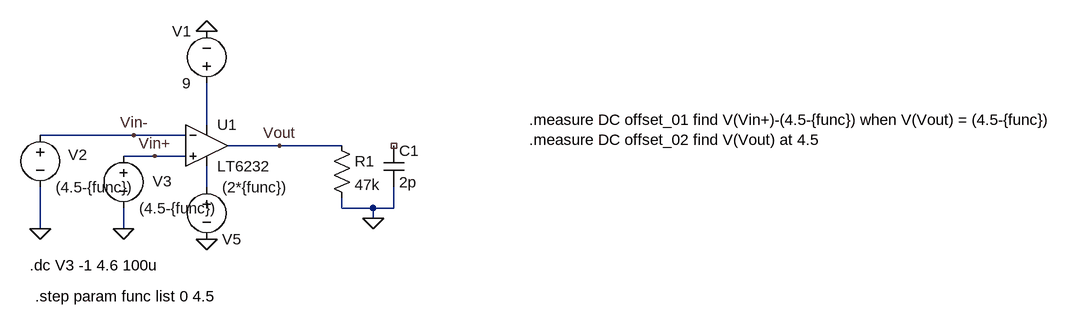
[diagram p0: schematic OpAmpTest_lt6232.asc]
OpAmpTest_lt6232.asc, the LTspice schematic file:
Version 4
SHEET 1 1664 792
WIRE 208 160 208 96
WIRE 96 176 -48 176
WIRE 176 176 96 176
WIRE 320 192 240 192
WIRE 416 192 320 192
WIRE 128 208 80 208
WIRE 176 208 128 208
WIRE 208 256 208 224
WIRE 416 288 416 272
WIRE 464 288 416 288
WIRE 496 288 496 256
WIRE 496 288 464 288
WIRE 464 304 464 288
WIRE -48 320 -48 256
WIRE 80 320 80 288
FLAG 208 16 0
FLAG 464 304 0
FLAG 80 320 0
FLAG -48 320 0
FLAG 96 176 Vin-
FLAG 128 208 Vin+
FLAG 320 192 Vout
FLAG 208 336 0
SYMBOL Opamps\\LT6232 208 192 R0
SYMATTR InstName U1
SYMBOL voltage 208 112 R180
WINDOW 0 24 96 Left 2
WINDOW 3 24 16 Left 2
WINDOW 123 0 0 Left 2
WINDOW 39 0 0 Left 2
SYMATTR InstName V1
SYMATTR Value 9
SYMBOL res 400 176 R0
SYMATTR InstName R1
SYMATTR Value 47k
SYMBOL cap 480 192 R0
SYMATTR InstName C1
SYMATTR Value 2p
SYMBOL voltage -48 160 R0
WINDOW 0 43 46 Left 2
WINDOW 123 24 124 Left 2
WINDOW 39 24 152 Left 2
SYMATTR InstName V2
SYMATTR Value (4.5-{func})
SYMBOL voltage 80 192 R0
WINDOW 0 45 55 Left 2
WINDOW 123 24 124 Left 2
WINDOW 39 24 152 Left 2
SYMATTR InstName V3
SYMATTR Value (4.5-{func})
SYMBOL voltage 208 240 R0
WINDOW 0 24 96 Left 2
WINDOW 3 24 16 Left 2
WINDOW 123 0 0 Left 2
WINDOW 39 0 0 Left 2
SYMATTR InstName V5
SYMATTR Value (2*{func})
TEXT -64 376 Left 2 !.dc V3 -1 4.6 100u
TEXT 704 152 Left 2 !.measure DC offset_01 find V(Vin+)-(4.5-{func}) when V(Vout) = (4.5-{func})\n.measure DC offset_02 find V(Vout) at 4.5
TEXT -56 424 Left 2 !.step param func list 0 4.5

The netlist it stands for:
* OpAmpTest_lt6232.asc
* U1: LT6232 (symbol Opamps\LT6232 not available, pins judged from their places): In+=Vin+ In-=Vin- V+=N001 V-=N002 OUT=Vout
V1 N001 0 9
R1 Vout 0 47k
C1 NC_01 0 2p
V2 Vin- 0 (4.5-{func})
V3 Vin+ 0 (4.5-{func})
V5 N002 0 (2*{func})
.dc V3 -1 4.6 100u
.measure DC offset_01 find V(Vin+)-(4.5-{func}) when V(Vout) = (4.5-{func})
.measure DC offset_02 find V(Vout) at 4.5
.step param func list 0 4.5
.backanno
.end